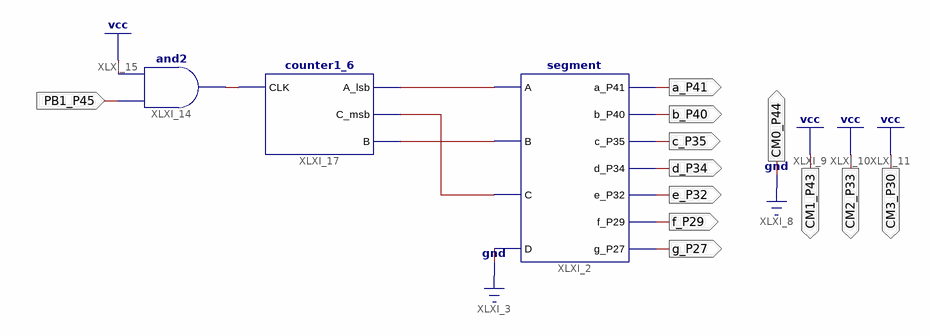
[diagram p0: schematic sheet 1]
// Xilinx ISE schematic chooseChannel.sch (spartan6) as structural Verilog: 3 symbols, 12 ports
module chooseChannel (
  input  PB1_P45,
  output a_P41,
  output b_P40,
  output c_P35,
  output d_P34,
  output e_P32,
  output f_P29,
  output g_P27,
  output CM0_P44,
  output CM1_P43,
  output CM2_P33,
  output CM3_P30
);

  wire XLXN_24, XLXN_29, XLXN_30, XLXN_31;

  segment XLXI_2 (
    .A(XLXN_29), .B(XLXN_30), .C(XLXN_31), .D(1'b0), .a_P41(a_P41), .b_P40(b_P40), .c_P35(c_P35),
    .d_P34(d_P34), .e_P32(e_P32), .f_P29(f_P29), .g_P27(g_P27));
  counter1_6 XLXI_17 (.CLK(XLXN_24), .A_lsb(XLXN_29), .C_msb(XLXN_31), .B(XLXN_30));
  and XLXI_14 (XLXN_24, PB1_P45, 1'b1);

  assign CM0_P44 = 1'b0;
  assign CM1_P43 = 1'b1;
  assign CM2_P33 = 1'b1;
  assign CM3_P30 = 1'b1;
endmodule
